# EAGLE design 20224 (EAGLE 7.6.0)
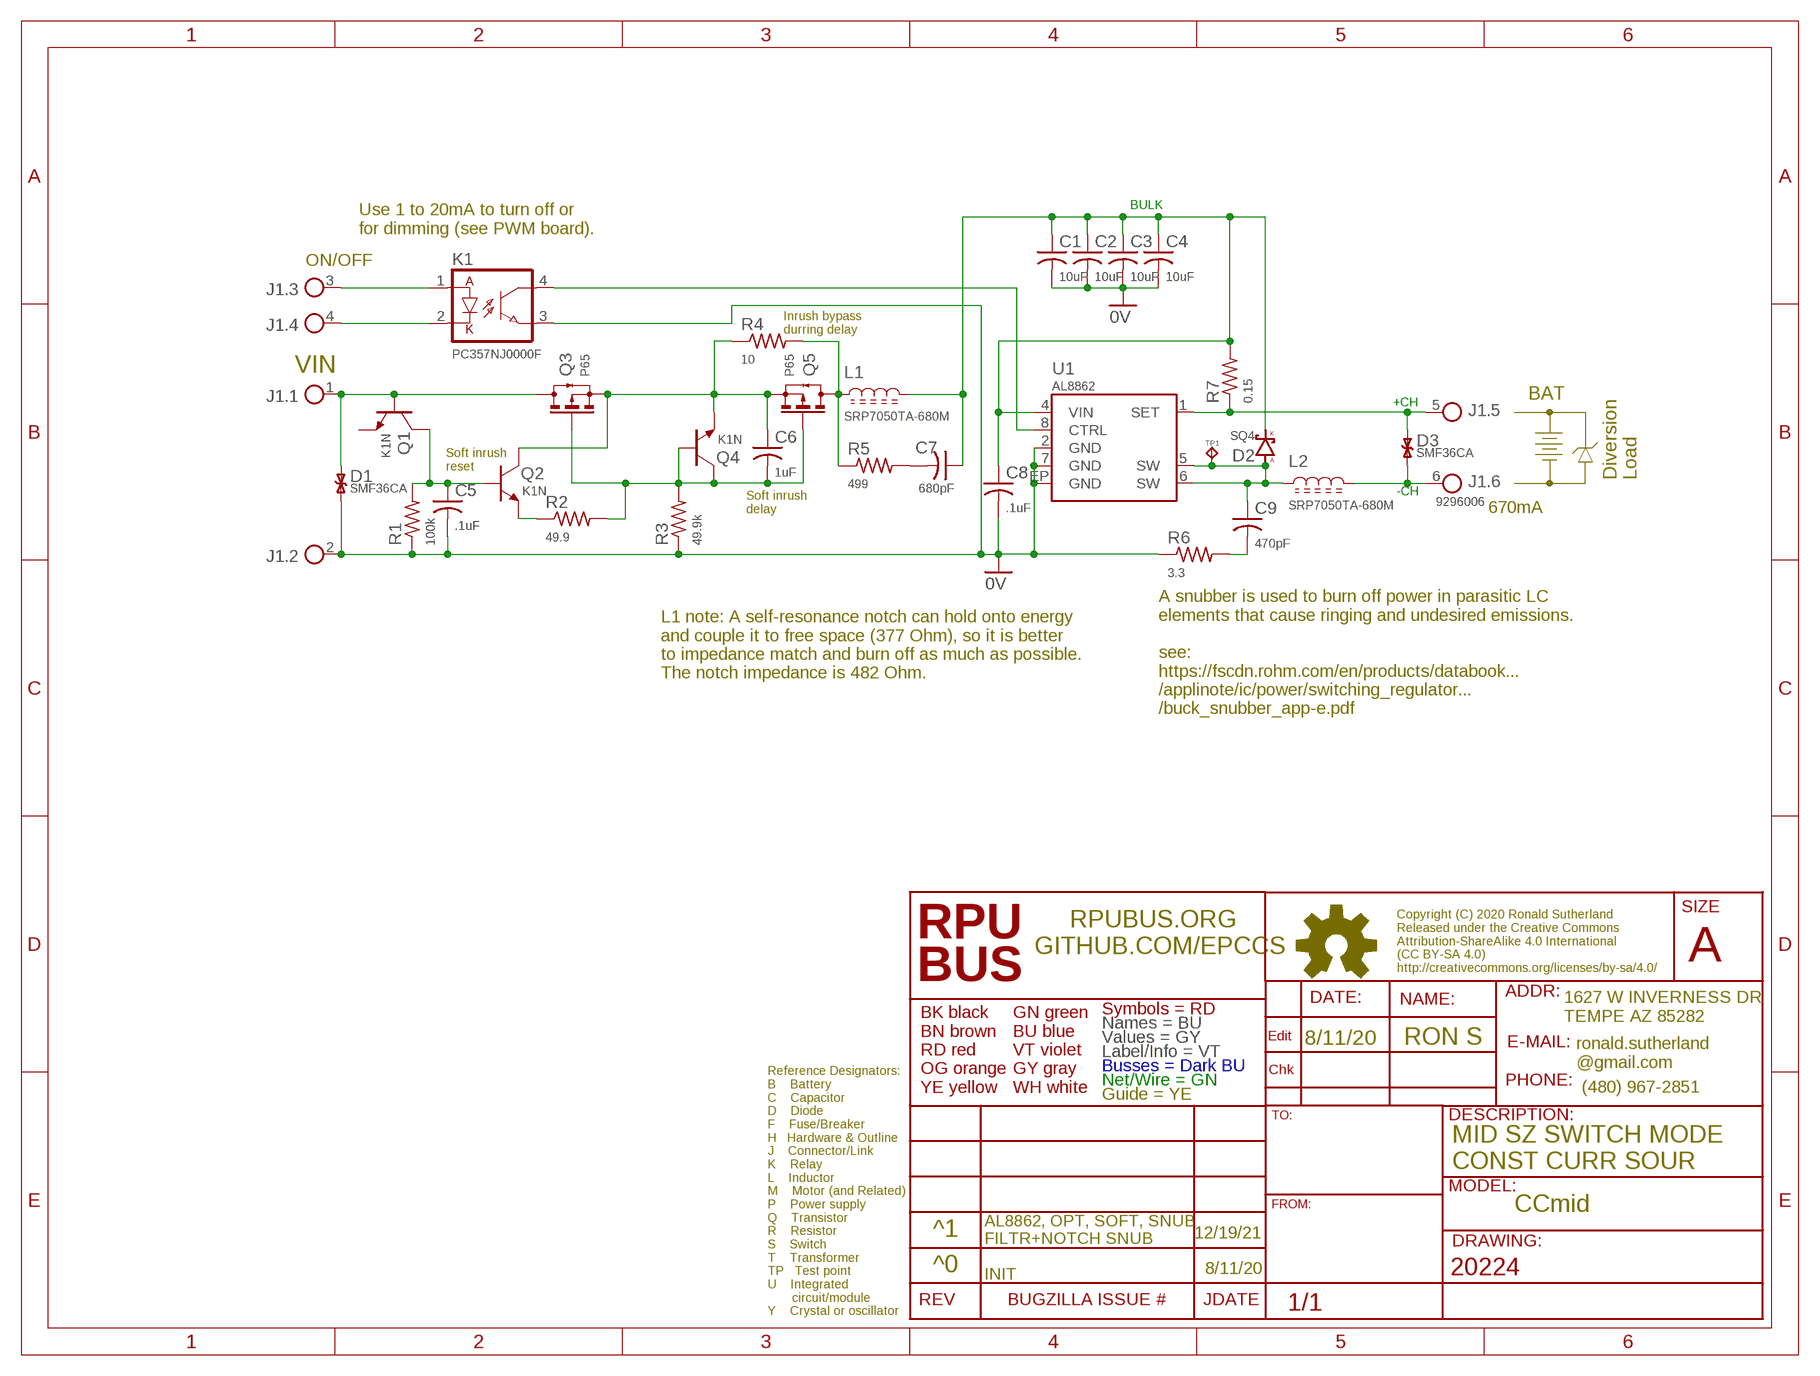
[diagram p0: schematic, sheet 1]

## Parts
C1  10uF  CC1206  [C1206(3216)]
C2  10uF  CC1206  [C1206(3216)]
C3  10uF  CC1206  [C1206(3216)]
C4  10uF  CC1206  [C1206(3216)]
C5  .1uF  CC0805A  [C0805(2012)]
C6  1uF  CC0805A  [C0805(2012)]
C7  680pF  CC0603A  [C0603(1608)]
C8  .1uF  CC0805A  [C0805(2012)]
C9  470pF  CC0603A  [C0603(1608)]
D1  SMF36CA  TVS-BISOD123  [SOD123]
D2  SQ4  DSMA  [SMA]
D3  SMF36CA  TVS-BISOD123  [SOD123]
J1  9296006  [06]
K1  PC357NJ0000F  FODM121SMD4  [SMD4]
L1  SRP7050TA-680M  L2626  [L2626]
L2  SRP7050TA-680M  L2626  [L2626]
Q1  K1N  NPNSOT23  [SOT23]
Q2  K1N  NPNSOT23  [SOT23]
Q3  P65  N-CHSOT23  [SOT23]
Q4  K1N  NPNSOT23  [SOT23]
Q5  P65  N-CHSOT23  [SOT23]
R1  100k  R0805  [C0805(2012)]
R2  49.9  R0805  [C0805(2012)]
R3  49.9k  R0805  [C0805(2012)]
R4  10  R1206  [C1206(3216)]
R5  499  R0805  [C0805(2012)]
R6  3.3  R0805  [C0805(2012)]
R7  0.15  R1210  [C1210(3225)]
TP1  TPPAD1-06  [P1-06]
U1  AL8862  AL8862SP-13  [SOIC8EP]

## Nets
0V: C1.2 C2.2 C3.2 C4.2 C5.2 C8.2 D1.A J1.2 K1.3(E) R1.1 R3.1 R6.1 U1.2(GND) U1.7(GND) U1.EP(GND)
+CH: D3.C J1.5 R7.1 U1.1(SET)
-CH: D3.A J1.6 L2.2
BULK: C1.1 C2.1 C3.1 C4.1 C7.1 C8.1 D2.K L1.2 R7.2 U1.4(VIN)
N$1: K1.4(C) U1.8(CTRL)
N$2: J1.3 K1.1(A)
N$3: C9.1 D2.A L2.1 TP1.TP U1.5(SW) U1.6(SW)
N$4: J1.4 K1.2(K)
N$5: L1.1 Q5.3(D)(D) R4.2 R5.1
N$6: C9.2 R6.2
N$7: C7.2 R5.2
N$8: D1.C J1.1 Q1.B Q3.3(D)(D)
N$9: C5.1 Q1.C Q2.B R1.2
N$10: Q2.E R2.1
N$32: C6.1 Q2.C Q3.2(S)(S) Q4.E Q5.2(S)(S) R4.1
N$33: C6.2 Q3.1(G)(G) Q4.B Q4.C Q5.1(G)(G) R2.2 R3.2
Unconnected: Q1.E

## Notes on the sheet
- Use 1 to 20mA to turn off or 
  for dimming (see PWM board).
- ON/OFF
- Inrush bypass 
  durring delay
- VIN
- BAT
- Soft inrush 
  reset
- Diversion 
  Load
- Soft inrush 
  delay
- 670mA
- L1 note: A self-resonance notch can hold onto energy
  and couple it to free space (377 Ohm), so it is better
  to impedance match and burn off as much as possible.
  The notch impedance is 482 Ohm.
- A snubber is used to burn off power in parasitic LC 
  elements that cause ringing and undesired emissions.
  
  see:
  https://fscdn.rohm.com/en/products/databook...
  /applinote/ic/power/switching_regulator...
  /buck_snubber_app-e.pdf
- 8/11/20 | RON S
- MID SZ SWITCH MODE 
  CONST CURR SOUR
- CCmid
- ^1 | 12/19/21
- AL8862, OPT, SOFT, SNUB
  FILTR+NOTCH SNUB
- ^0 | 8/11/20
- INIT

## Library data of the parts
C1-C9 = C-C:C: CAPACITOR Symbol
D1 D3 = D-TVS:TVS-BI: Bi-directional Transient Voltage Suppressors
D2 = D-SBR:D: DIODE
J1 = J-PokeIn:9296006: [KYOCERA,009296006202906] 6POS POKE-IN
K1 = K-OPT:FODM121: 121 [FAIRCHILD,FODM121AR2] OPTOCOUPLER TRANSISTOR 3750VRMS 4SMD [SHARP,PC357NJ0000F] OPTOISO 3.75KV TRANSISTOR 4BESOP
L1 L2 = L-PWR:L: Inductor
Q1 Q2 Q4 = Q-NPN:NPN: BJT NPN General Purpose Amplifier
Q3 Q5 = Q-PCH:N-CH?*: ENHANCEMENT MODE MOSFET SOT23 is BSS138 pinout
R1-R7 = R-C:R: Resiistor American-style symbol
TP1 = J-TP:TP: Test pad
U1 = U-LED:AL8862: AL8862 [DIODES,AL8862SP-13] CURR DRIVER SO8EP AL8862["SP":"SO-8EP"]["-13":"Tape/Reel"]

## Net classes
0 default: width 0.178 mm, drill 0.33 mm

## Board
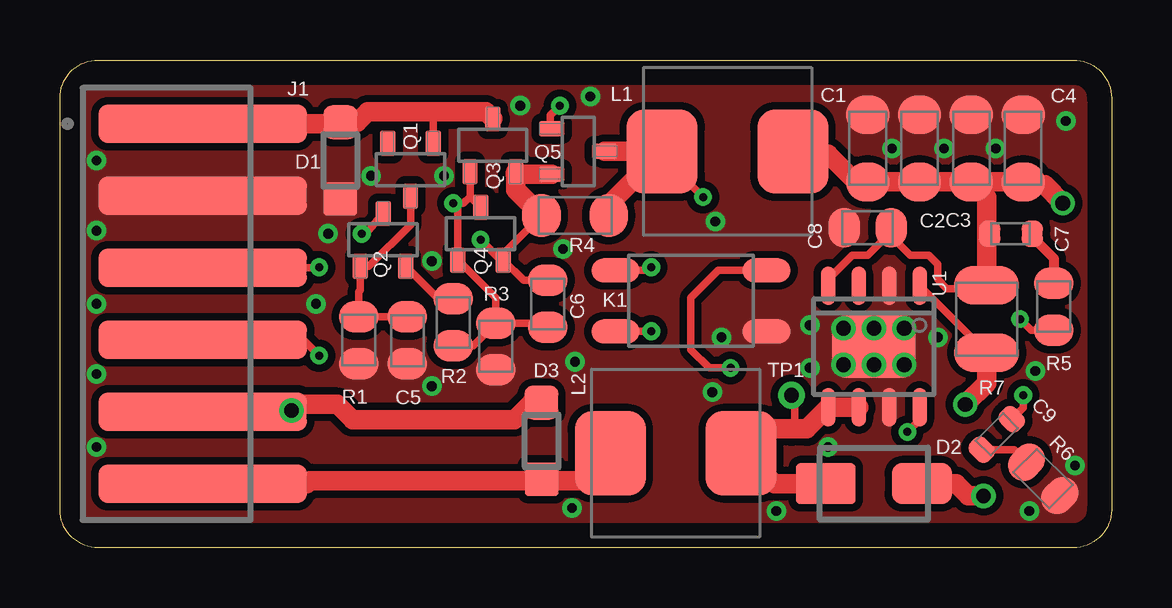
[diagram p1: board, top side]
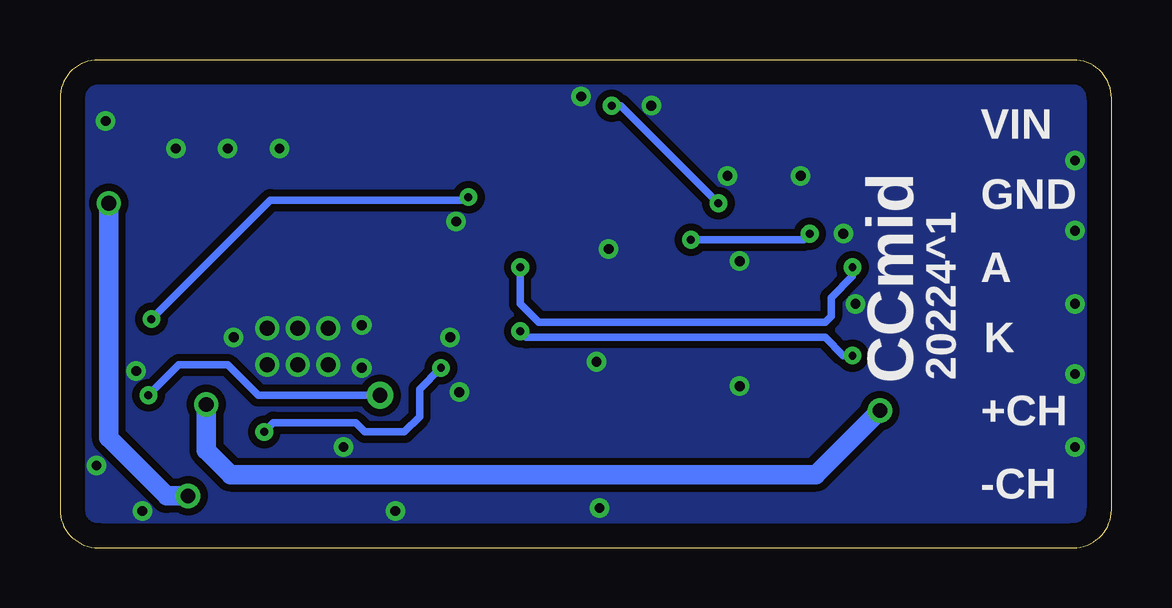
[diagram p2: board, bottom side, seen from below]

Size 43.81 x 20.32 mm. Coordinates in mm from the lower left corner, seen from the top.
Outline: 43.81,18.73 43.81,1.59 arc-90 42.23,0 1.59,0 arc-90 0,1.59 0,18.73 arc-90 1.59,20.32 42.23,20.32 arc-90 43.81,18.73
Copper layers (1*16): Top 0.034290625mm / dielectric 60mil / Bottom 0.034290625mm
Design rules "default *": minimum track width 10mil, minimum drill 13mil, track to track 8mil, track to pad 8mil, pad to pad 8mil, via to via 8mil, smd to smd 8mil, copper to edge 40mil, drill to drill 12mil, minimum pad ring 10mil, minimum via ring 8mil, stop-mask expansion 4mil, vias tented up to drill 17mil, thermal gap 10mil

### Footprints (pad centres in the part's own frame; a part is rotated, then mirrored left to right if it is on the bottom)
C1206(3216) = smd 1.6 x 1.8: 1 -1.4,0; 2 1.4,0
C0805(2012) = smd 1.321 x 1.651: 1 -0.977,0; 2 0.977,0
C0603(1608) = smd 0.898 x 1.1: 1 -0.889,0; 2 0.889,0
SOD123 = smd 1.4 x 1.4: A 1.6,0; C -1.6,0
SMA = smd 2.5 x 1.7: A 2,0; K -2,0
06 = smd 1.6 x 8.7: 1 -7.5,1.5; 2 -4.5,1.5; 3 -1.5,1.5; 4 1.5,1.5; 5 4.5,1.5; 6 7.5,1.5
SMD4 = smd 1 x 2: 1 -1.27,-3.15; 2 1.27,-3.15; 3 1.27,3.15; 4 -1.27,3.15
L2626 = smd 2.95 x 3.5: 1 2.725,0; 2 -2.725,0
SOT23 = smd 0.65 x 1.06: B -0.95,-1.1; C 0,1.1; E 0.95,-1.1
SOT23' = smd 0.65 x 1.06: 1(G) -0.95,-1.1; 2(S) 0.95,-1.1; 3(D) 0,1.1
C1210(3225) = smd 1.6 x 2.7: 1 -1.4,0; 2 1.4,0
P1-06 = drill 0.61: TP 0,0
SOIC8EP = smd 0.6 x 1.6: 1 -1.905,-2.54; 2 -0.635,-2.54; 3 0.635,-2.54; 4 1.905,-2.54; 5 1.905,2.54; 6 0.635,2.54; 7 -0.635,2.54; 8 -1.905,2.54 | smd 3.5 x 2.6: EP 0,0

### Placement (x,y rotation side)
C1  33.66,16.64 90 top
C2  35.81,16.64 90 top
C3  37.97,16.64 90 top
C4  40.13,16.64 90 top
C5  14.48,8.64 270 top
C6  20.32,10.16 270 top
C7  39.62,13.08 0 top
C8  33.66,13.34 180 top
C9  39.03,4.71 225 top
D1  11.68,16.13 270 top
D2  33.91,2.67 180 top
D3  20.07,4.45 270 top
J1  4.45,10.16 270 top
K1  26.29,10.29 270 top
L1  27.81,16.51 180 top
L2  25.65,3.94 0 top
Q1  14.61,15.75 180 top
Q2  13.46,12.83 0 top
Q3  P65  [SOT23']  18.03,16.76 0 top
Q4  17.53,13.08 0 top
Q5  P65  [SOT23']  21.59,16.51 270 top
R1  12.45,8.64 90 top
R2  16.38,9.4 270 top
R3  18.16,8.38 90 top
R4  21.46,13.84 0 top
R5  41.4,10.03 90 top
R6  40.97,2.87 135 top
R7  38.61,9.53 90 top
TP1  30.48,6.35 0 top
U1  33.91,8.38 180 top

### Tracks (layer width: path | path; a pad name or v marks a point on that pad's centre or on a via)
0V  (via drill 0.41, 0.61)
  other vias: 41.91,17.78 32.64,9.14 35.18,9.14 32.64,7.62 35.18,7.62 40.39,1.52 42.29,3.43 29.84,1.52 1.52,4.19 1.52,7.24 1.52,10.16 1.52,13.21 1.52,16.13 21.46,7.75 27.56,8.76 40.64,7.37 38.99,16.64 36.83,16.64 34.67,16.64 36.58,8.76 31.24,9.27 31.24,7.49 27.18,6.48 15.49,6.73 10.67,10.16 11.18,13.08 27.3,13.59 21.34,1.65 33.91,9.14 33.91,7.62 32,4.19 19.18,18.41 20.95,12.45 22.1,18.8 15.49,11.94 12.95,15.49 16,15.49
  pour Top (isolate 0.305, no thermals): 43.81,0 0,0 0,20.32 43.81,20.32
  pour Bottom (isolate 0.305, no thermals): 0,20.32 43.81,20.32 43.81,0 0,0
+CH  (via drill 0.61)
  Top 0.305: U1.1 38.1,8.64 38.1,8.38 R7.1
  Top 0.813: R7.1 38.61,6.86 v37.72,5.97 | J1.5 6,5.71 v9.65,5.71 9.91,5.97 11.56,5.97 12.19,5.33 18.92,5.33 19.63,6.04 D3.C
  Bottom 0.813: v37.72,5.97 37.72,4.06 36.7,3.05 12.32,3.05 v9.65,5.71
-CH
  Top 0.813: J1.6 10.28,2.66 10.41,2.79 20.32,2.79 | 20.32,2.79 21.79,2.79 L2.2 | D3.A 20.12,2.72 20.32,2.79
BULK  (via drill 0.61)
  Top 0.305: 34.54,13.08 33.66,12.19 33.02,12.19 32.13,11.3 32.13,11.05 U1.4 | C7.1 38.61,12.7 | C8.1 34.54,13.08 | 34.54,13.08 35.43,12.19 36.2,12.19 36.58,11.81 36.58,11.18 36.96,10.79 38.48,10.79 R7.2
  Top 0.813: R7.2 38.61,12.7 38.61,14.6 C3.1 | C3.1 C4.1 40.26,15.11 41.02,15.11 v41.78,14.35 | C3.1 C2.1 C1.1 33.15,15.24 32,16.38 30.66,16.38 L1.2 | D2.K 37.34,2.67 37.85,2.16 v38.48,2.16
  Bottom 0.813: v38.48,2.16 39.37,2.16 41.78,4.57 v41.78,14.35
N$1  (via drill 0.33)
  Top 0.305: U1.8 35.81,5.33 v35.31,4.83 | v27.94,7.49 27.05,7.49 26.29,8.26 26.29,10.41 27.43,11.56 K1.4
  Bottom 0.305: v35.31,4.83 34.92,5.21 31.5,5.21 31.11,4.83 29.46,4.83 28.83,5.46 28.83,6.6 v27.94,7.49
N$2  (via drill 0.33)
  Top 0.305: J1.3 10.77,11.66 v10.79,11.68 | v24.64,11.68 24.51,11.56 K1.1
  Bottom 0.305: v10.79,11.68 10.79,11.3 11.68,10.41 11.68,9.65 11.94,9.4 23.88,9.4 24.64,10.16 v24.64,11.68
N$3  (via drill 0.33)
  Top 0.305: C9.1 40.13,5.82 v40.13,6.35 | 30.48,4.95 30.61,5.08 30.61,6.22 TP1.TP
  Top 0.813: U1.6 U1.5 31.11,4.95 30.48,4.95 29.39,4.95 L2.1 29.78,2.67 D2.A
  Bottom 0.305: v40.13,6.35 38.86,7.62 36.83,7.62 35.56,6.35 TP1.TP
N$4  (via drill 0.33)
  Top 0.305: J1.4 10.14,8.66 v10.79,8 | v24.64,9.02 K1.2
  Bottom 0.305: v10.79,8 11.18,8 11.94,8.76 24.38,8.76 v24.64,9.02
N$5  (via drill 0.33)
  Top 0.305: R5.1 40.47,9.06 v40.01,9.53 | v26.8,14.61 26.29,15.11 26.29,15.31 L1.1
  Top 0.813: Q5.3(D) L1.1 22.86,14.29 R4.2
  Bottom 0.305: v40.01,9.53 35.05,14.48 26.92,14.48 v26.8,14.61
N$6
  Top 0.305: C9.2 39.75,4.09 R6.2
N$7
  Top 0.406: C7.2 40.77,12.7 41.4,12.06 R5.2
N$8
  Top 0.305: Q1.B 15.55,18.1 15.49,18.16
  Top 0.813: J1.1 11.62,17.66 D1.C 12.39,17.73 12.83,18.16 15.49,18.16 17.74,18.16 Q3.3(D)
N$9
  Top 0.305: C5.1 R1.2 12.45,10.67 12.51,10.73 Q2.B 12.87,11.73 14.61,13.46 Q1.C
N$10
  Top 0.305: R2.1 15.76,10.38 Q2.E
N$32  (via drill 0.33)
  Top 0.305: C6.1 19.32,11.14 Q4.E | Q4.E 18.48,12.26 R4.1 | Q4.E 18.37,11.98 v17.53,12.83 | v12.57,13.08 12.74,13.08 Q2.C
  Top 0.813: R4.1 18.98,14.92 Q3.2(S) 18.96,15.56 Q5.2(S)
  Bottom 0.305: v17.53,12.83 12.83,12.83 v12.57,13.08
N$33  (via drill 0.33)
  Top 0.305: 16.96,15.81 Q3.1(G) 17.08,14.62 | Q5.1(G) 20.43,17.4 20.43,18.02 v20.83,18.41 | 17.08,14.62 Q4.C | R3.2 18.16,10.41 16.59,11.98 Q4.B 16.58,14.16 v16.38,14.35 16.81,14.35 17.08,14.62 | R2.2 17.22,8.42 R3.2 | R3.2 20.14,9.36 C6.2
  Bottom 0.305: v20.83,18.41 20.45,18.41 v16.38,14.35

### Text on the board
bPlace: VIN | GND | A | K | 20224^1 | CCmid | +CH | -CH